# EAGLE design fan_control_unit (EAGLE 7.2.0)
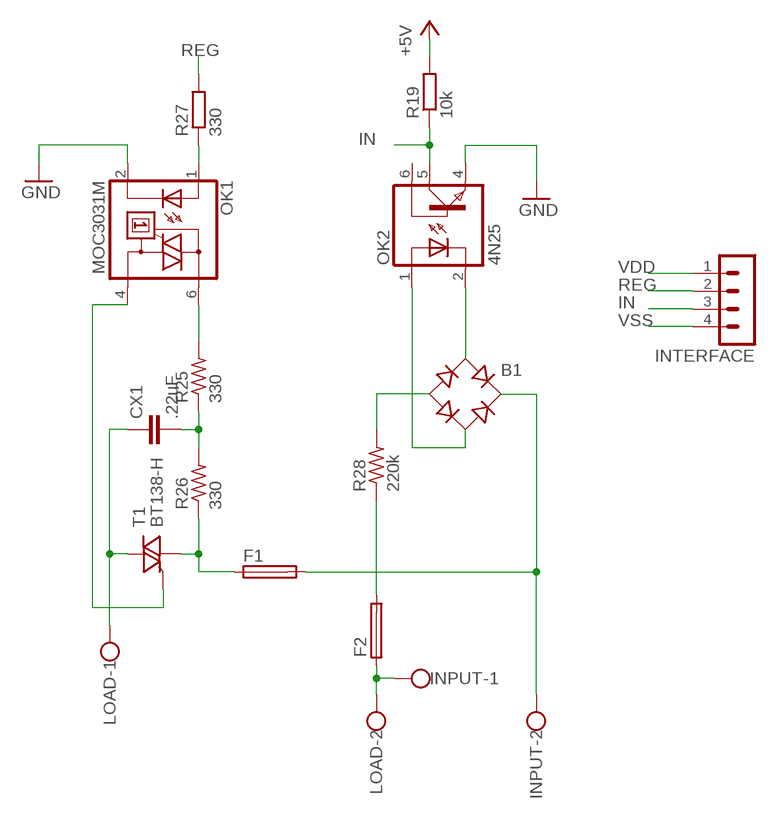
[diagram p0: schematic, sheet 1]

## Parts
B1  RB1A  [RB1A]
CX1  .22uF  C-EU150-054X183  [C150-054X183]
F1  SH22,5A  [SH22,5A]
F2  SH22,5A  [SH22,5A]
INPUT  W237-102  [W237-102]
INTERFACE  MA04-1  [MA04-1]
LOAD  W237-102  [W237-102]
OK1  MOC3031M  [DIL06]
OK2  4N25  4N35  [DIL06]
R19  10k  R-EU_R1206  [R1206]
R25  330  R-US_0207/15  [0207/15]
R26  330  R-US_0207/15  [0207/15]
R27  330  R-EU_R1206  [R1206]
R28  220k  R-US_0207/15  [0207/15]
T1  BT138-H  [TO220BH]

## Nets
GATE: OK1.4(A1) T1.G
IN: INTERFACE.3 OK2.5(COL) R19.1
N$1: F1.1 R26.1 T1.T1(A1)
N$2: F2.2 R28.1
N$3: F2.1 INPUT.1 LOAD.2
N$23: B1.AC1 OK2.2(C)
N$24: B1.AC2 OK2.1(A)
N$26: OK1.6(A2) R25.2
N$28: CX1.1 LOAD.1 T1.T2(A2)
N$34: OK1.1(A) R27.1
N$35: CX1.2 R25.1 R26.2
N$38: B1.- R28.2
N$40: B1.+ F1.2 INPUT.2
REG: INTERFACE.2 R27.2
VDD: INTERFACE.1 R19.2 ; supply symbol labelled +5V
VSS: INTERFACE.4 OK1.2(C) OK2.4(EMI) ; supply symbol labelled GND
Unconnected: OK2.6(BAS)

## Library data of the parts
B1 = rectifier:RB1A: RECTIFIER 1 A
CX1 = resistor:C-EU: CAPACITOR, European symbol
F1 F2 = fuse:SH22,5A: FUSE HOLDER grid 22,5mm, isolated cap OGN0031 8201, Schurter (Buerklin); MPN: 0031.7701.11; OC_FARNELL: unknown; OC_NEWARK: 04F1224
INPUT LOAD = con-wago-500:W237-102: WAGO SCREW CLAMP; MPN: 237-102; OC_FARNELL: unknown; OC_NEWARK: 70K9898
INTERFACE = con-lstb:MA04-1: PIN HEADER; OC_FARNELL: unknown; OC_NEWARK: unknown
OK1 = optocoupler:MOC30*: 6-Pin DIP Zero-Cross Optoisolators Triac Driver Output (250/400 Volt Peak) Source: Data sheet <http://www.fairchildsemi.com/ds/MO/MOC3031M.pdf> The old path of data sheet not more available 2013-05-06.; MF: FAIRCHILD SEMICONDUCTOR; MPN: MOC3031M; OC_FARNELL: 9875964; OC_NEWARK: 78K6089
OK2 = optocoupler:4N35: MOTOROLA OPTO COUPLER; MF: FAIRCHILD SEMICONDUCTOR; MPN: 4N35; OC_FARNELL: 1328375; OC_NEWARK: 72K9946
R19 R27 = rcl:R-EU_: RESISTOR, European symbol
R25 R26 R28 = rcl:R-US_: RESISTOR, American symbol
T1 = triac:BT138: TRIAC Source: http://www.semiconductors.philips.com BT138_SERIES_2.pdf

## Board
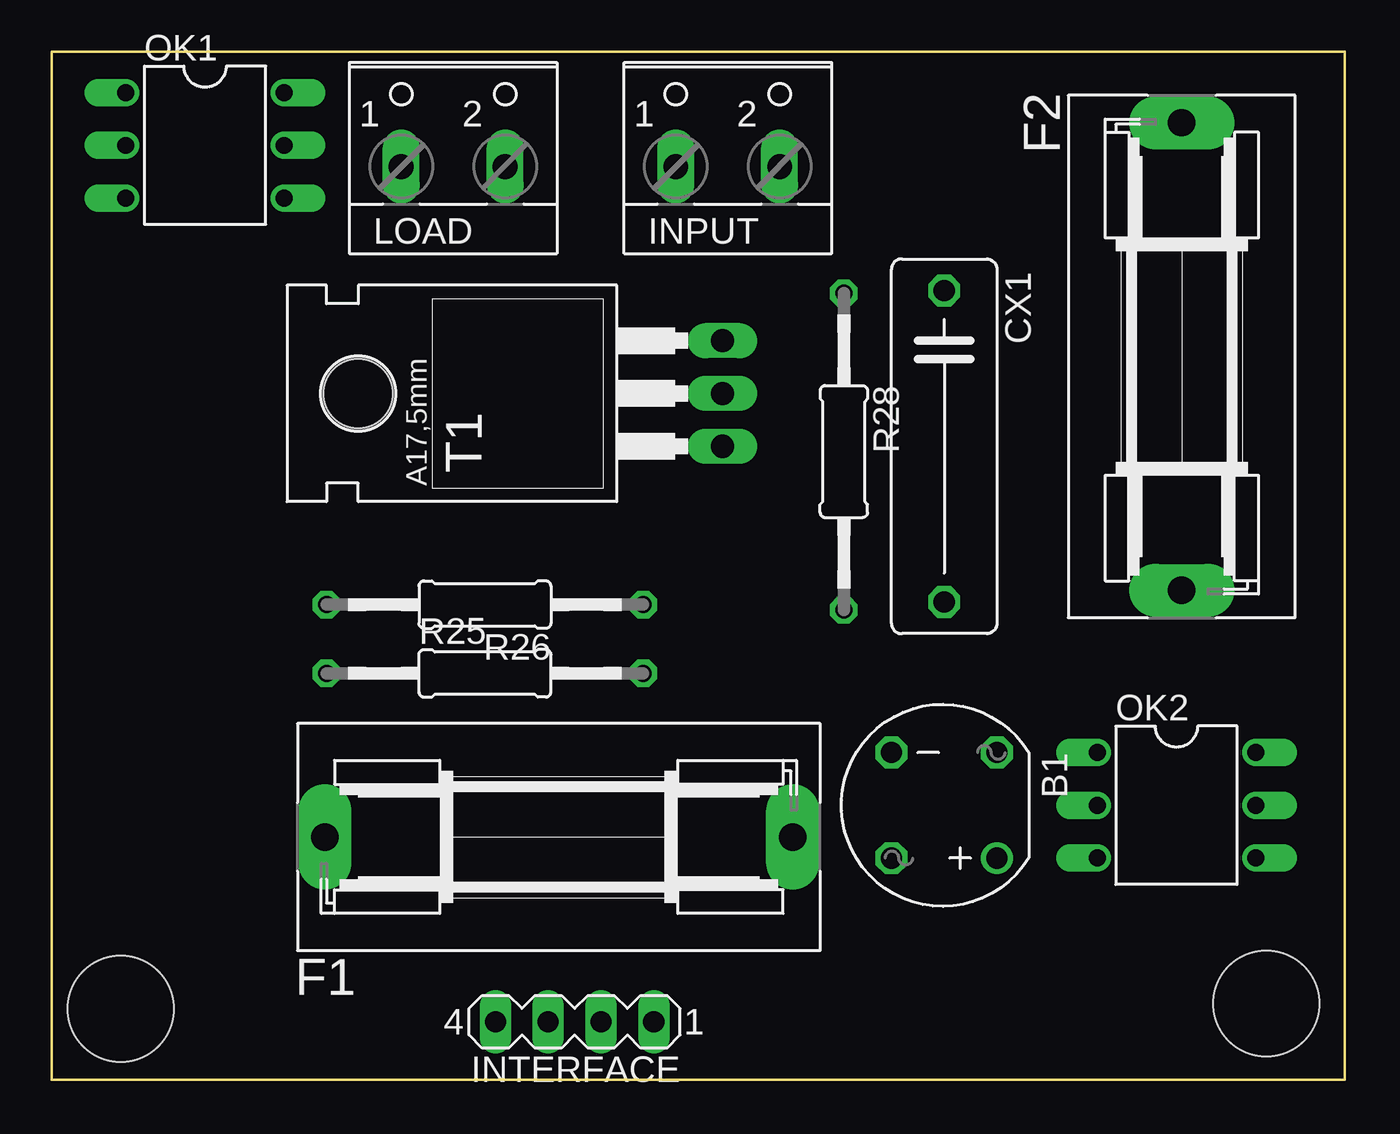
[diagram p1: board, top side]
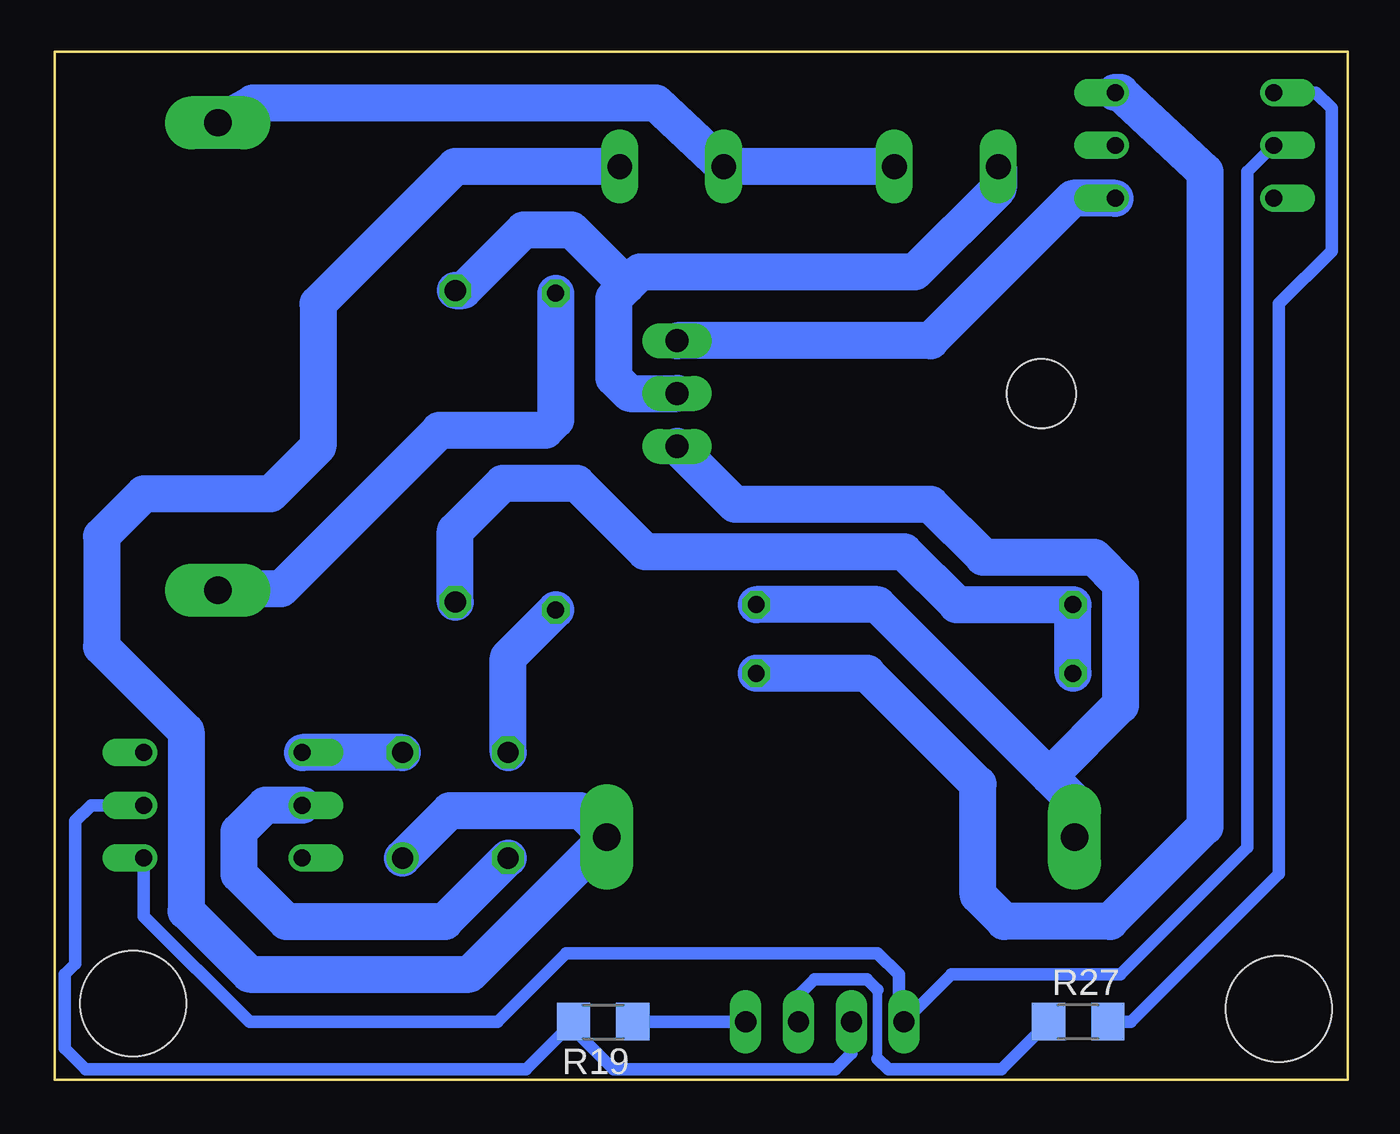
[diagram p2: board, bottom side, seen from below]

Size 62.21 x 49.45 mm. Coordinates in mm from the lower left corner, seen from the top.
Outline: 0,0 62.21,0 62.21,49.45 0,49.45 0,0
Copper layers (1*16): Top 0.035mm / dielectric 1.5mm / Bottom 0.035mm
Design rules "default": minimum track width 10mil, minimum drill 24mil, track to track 8mil, track to pad 8mil, pad to pad 8mil, via to via 8mil, smd to smd 8mil, copper to edge 40mil, drill to drill 8mil, minimum pad ring 10mil, minimum via ring 8mil, stop-mask expansion 4mil, vias tented up to drill 0mil, thermal gap 10mil
Holes 5.08 mm at 3.31,3.41 58.43,3.67

### Footprints (pad centres in the part's own frame; a part is rotated, then mirrored left to right if it is on the bottom)
RB1A = drill 1.016: + -2.54,2.54 | drill 1.016 octagon: - 2.54,-2.54; AC1 2.54,2.54; AC2 -2.54,-2.54
C150-054X183 = drill 1.016 octagon: 1 -7.493,0; 2 7.493,0
SH22,5A = drill 1.321 pad 2.54 long: 1 -11.252,0; 2 11.252,0
W237-102 = drill 1.194 long: 1 -2.5,-1.27; 2 2.5,-1.27
MA04-1 = drill 1.016 long: 1 -3.81,0; 2 -1.27,0; 3 1.27,0; 4 3.81,0
DIL06 = drill 0.813 offset: 1 -2.54,-3.81; 2 0,-3.81; 3 2.54,-3.81; 4 2.54,3.81; 5 0,3.81; 6 -2.54,3.81
R1206 = smd 1.6 x 1.803: 1 -1.422,0; 2 1.422,0
0207/15 = drill 0.813 octagon: 1 -7.62,0; 2 7.62,0
TO220BH = drill 1.118 long: G 2.54,-6.35; T1 -2.54,-6.35; T2 0,-6.35 | hole 3.302: 0,11.176

### Placement (x,y rotation side)
B1  42.93,13.21 180 top
CX1  42.93,30.48 270 top
F1  24.38,11.68 0 top
F2  54.36,34.8 270 top
INPUT  32.51,45.21 0 top
INTERFACE  25.15,2.79 180 top
LOAD  19.3,45.21 0 top
OK1  7.37,44.96 270 top
OK2  54.1,13.21 270 top
R19  35.81,2.79 180 bottom
R25  20.83,19.56 0 top
R26  20.83,22.86 180 top
R27  12.95,2.79 0 bottom
R28  38.1,30.23 270 top
T1  25.91,33.02 90 top

### Tracks (layer width: path | path; a pad name or v marks a point on that pad's centre or on a via)
GATE
  Bottom 1.778: OK1.4 13.21,42.42 20.07,35.56 T1.G
IN
  Bottom 0.61: OK2.5 60.45,13.21 61.21,12.45 61.21,5.59 61.72,5.08 61.72,1.52 60.71,0.51 39.52,0.51 37.24,2.79 37.24,2.44 35.31,0.51 24.64,0.51 23.88,1.27 INTERFACE.3
N$1
  Bottom 1.778: F1.1 13.13,13.39 14.35,14.61 | 14.35,14.61 22.61,22.86 R26.1 | 14.35,14.61 10.92,18.03 10.92,23.88 12.19,25.15 17.53,25.15 20.07,27.69 29.46,27.69 T1.T1
N$2
  Bottom 1.778: R28.1 38.1,31.75 38.61,31.24 43.69,31.24 51.31,23.62 54.28,23.62 F2.2
N$3
  Bottom 1.778: LOAD.2 INPUT.1 33.27,46.99 52.65,46.99 F2.1
N$23
  Bottom 1.778: OK2.2 52.07,13.21 53.34,11.94 53.34,9.91 51.05,7.62 43.43,7.62 B1.AC1
N$24
  Bottom 1.778: B1.AC2 OK2.1
N$26
  Bottom 1.778: OK1.6 10.92,47.5 6.86,43.69 6.86,12.19 11.43,7.62 16.51,7.62 17.78,8.89 17.78,14.22 23.11,19.56 R25.2
N$28
  Bottom 1.778: LOAD.1 16.8,42.89 20.83,38.86 34.04,38.86 34.67,38.23 | 34.67,38.23 35.31,37.59 35.31,33.78 34.54,33.02 T1.T2 | CX1.1 42.55,37.97 39.62,40.89 37.34,40.89 34.67,38.23
N$34
  Bottom 0.61: 11.53,2.79 10.41,2.79 3.3,9.91 3.3,37.34 0.76,39.88 0.76,46.74 1.52,47.5 OK1.1
N$35
  Bottom 1.778: R25.1 R26.2 18.8,22.86 21.34,25.4 33.78,25.4 37.08,28.7 40.64,28.7 42.93,26.42 CX1.2
N$38
  Bottom 1.778: B1.- 40.39,20.32 R28.2
N$40
  Bottom 1.778: INPUT.2 42.93,43.94 49.53,37.34 49.53,30.48 51.82,28.19 57.91,28.19 59.94,26.16 59.94,20.83 55.88,16.76 55.88,8.13 52.83,5.08 42.24,5.08 F1.2 36.91,12.95 43.18,12.95 B1.+
REG
  Bottom 0.457: 22.61,4.32 22.61,1.02
  Bottom 0.61: INTERFACE.2 26.42,4.06 25.65,4.83 23.11,4.83 22.61,4.32 | 22.61,1.02 22.1,0.51 16.66,0.51 14.38,2.79
VDD
  Bottom 0.61: 34.39,2.79 INTERFACE.1
VSS
  Bottom 0.61: OK2.4 57.91,7.87 52.83,2.79 40.89,2.79 37.59,6.1 22.61,6.1 21.59,5.08 21.59,3.05 INTERFACE.4 19.05,5.08 10.92,5.08 4.83,11.18 4.83,43.69 OK1.2

### Text on the board
tDocu: A_N | A_L | N | L